# Altium schematic sheet XMC4800-Core.SchDoc: XMC4800-Core
size A4
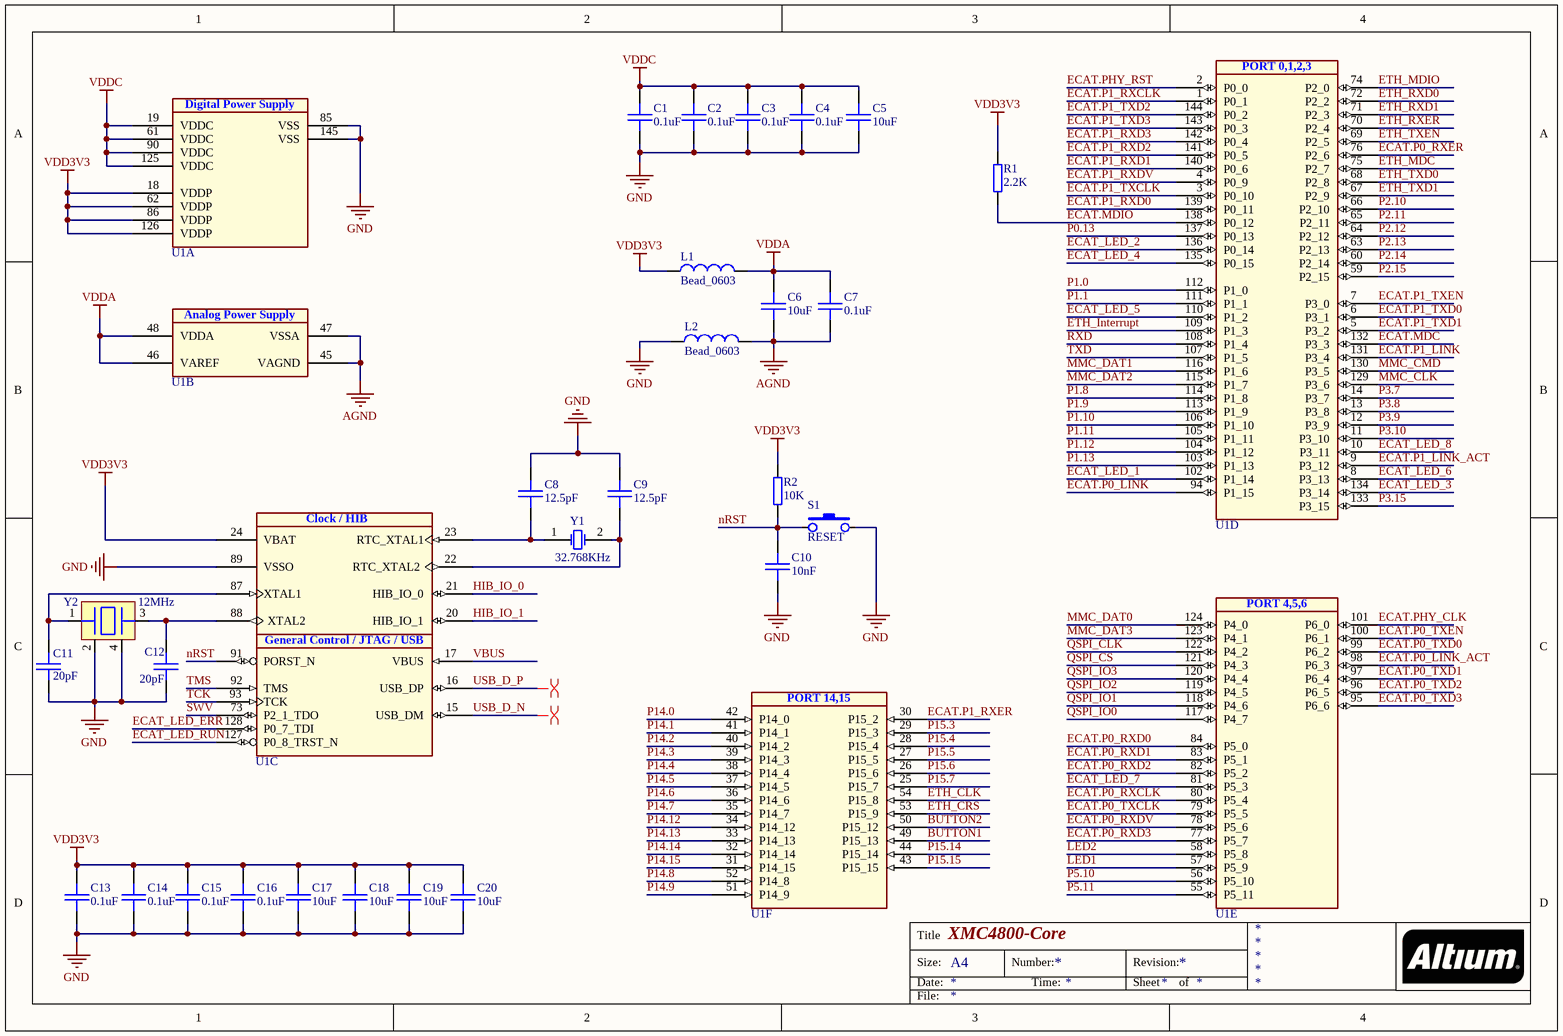
[diagram p0: XMC4800-Core.SchDoc]

## Parts
C1  0.1uF  [CAP-0603]
C2  0.1uF  [CAP-0603]
C3  0.1uF  [CAP-0603]
C4  0.1uF  [CAP-0603]
C5  10uF  [CAP-0603]
C6  10uF  [CAP-0603]
C7  0.1uF  [CAP-0603]
C8  12.5pF  [CAP-0603]
C9  12.5pF  [CAP-0603]
C10  10nF  [CAP-0603]
C11  20pF  [CAP-0603]
C12  20pF  [CAP-0603]
C13  0.1uF  [CAP-0603]
C14  0.1uF  [CAP-0603]
C15  0.1uF  [CAP-0603]
C16  0.1uF  [CAP-0603]
C17  10uF  [CAP-0603]
C18  10uF  [CAP-0603]
C19  10uF  [CAP-0603]
C20  10uF  [CAP-0603]
L1  Bead_0603  [L-0603]
L2  Bead_0603  [L-0603]
R1  2.2K  [RES-0603]
R2  10K  [RES-0603]
S1  RESET  [KEY_3X4X2]
U1  XMC4800-F144F1024  [QFP50P2200X2200X160-145N-2]  (value not drawn)  (parts A,B,C,D,E,F of 6)
Y1  32.768KHz  [FC-135(3215)]
Y2  12MHz  [LC-SMD-3225_4P]

## Nets
AGND: C6.2 C7.2 L2.2 U1.45(VAGND) U1.47(VSSA)
GND: C1.2 C2.2 C3.2 C4.2 C5.2 C8.1 C9.1 C10.2 C11.2 C12.2 C13.2 C14.2 C15.2 C16.2 C17.2 C18.2 C19.2 C20.2 L2.1 S1.2 U1.85(VSS) U1.89(VSSO) U1.145(VSS) Y2.2 Y2.4
VDD3V3: C13.1 C14.1 C15.1 C16.1 C17.1 C18.1 C19.1 C20.1 L1.1 R1.2 R2.2 U1.18(VDDP) U1.24(VBAT) U1.62(VDDP) U1.86(VDDP) U1.126(VDDP)
VDDA: C6.1 C7.1 L1.2 U1.46(VAREF) U1.48(VDDA)
VDDC: C1.1 C2.1 C3.1 C4.1 C5.1 U1.19(VDDC) U1.61(VDDC) U1.90(VDDC) U1.125(VDDC)
BUTTON1: U1.49(P15_13)
BUTTON2: U1.50(P15_12)
ECAT.MDC: U1.132(P3_3)
ECAT.MDIO: R1.1 U1.138(P0_12)
ECAT.P0_LINK: U1.94(P1_15)
ECAT.P0_LINK_ACT: U1.98(P6_3)
ECAT.P0_RXCLK: U1.80(P5_4)
ECAT.P0_RXD0: U1.84(P5_0)
ECAT.P0_RXD1: U1.83(P5_1)
ECAT.P0_RXD2: U1.82(P5_2)
ECAT.P0_RXD3: U1.77(P5_7)
ECAT.P0_RXDV: U1.78(P5_6)
ECAT.P0_RXER: U1.76(P2_6)
ECAT.P0_TXCLK: U1.79(P5_5)
ECAT.P0_TXD0: U1.99(P6_2)
ECAT.P0_TXD1: U1.97(P6_4)
ECAT.P0_TXD2: U1.96(P6_5)
ECAT.P0_TXD3: U1.95(P6_6)
ECAT.P0_TXEN: U1.100(P6_1)
ECAT.P1_LINK: U1.131(P3_4)
ECAT.P1_LINK_ACT: U1.9(P3_12)
ECAT.P1_RXCLK: U1.1(P0_1)
ECAT.P1_RXD0: U1.139(P0_11)
ECAT.P1_RXD1: U1.140(P0_6)
ECAT.P1_RXD2: U1.141(P0_5)
ECAT.P1_RXD3: U1.142(P0_4)
ECAT.P1_RXDV: U1.4(P0_9)
ECAT.P1_RXER: U1.30(P15_2)
ECAT.P1_TXCLK: U1.3(P0_10)
ECAT.P1_TXD0: U1.6(P3_1)
ECAT.P1_TXD1: U1.5(P3_2)
ECAT.P1_TXD2: U1.144(P0_2)
ECAT.P1_TXD3: U1.143(P0_3)
ECAT.P1_TXEN: U1.7(P3_0)
ECAT.PHY_CLK: U1.101(P6_0)
ECAT.PHY_RST: U1.2(P0_0)
ECAT_LED_1: U1.102(P1_14)
ECAT_LED_2: U1.136(P0_14)
ECAT_LED_3: U1.134(P3_14)
ECAT_LED_4: U1.135(P0_15)
ECAT_LED_5: U1.110(P1_2)
ECAT_LED_6: U1.8(P3_13)
ECAT_LED_7: U1.81(P5_3)
ECAT_LED_8: U1.10(P3_11)
ECAT_LED_ERR: U1.128(P0_7_TDI)
ECAT_LED_RUN: U1.127(P0_8_TRST_N)
ETH_CLK: U1.54(P15_8)
ETH_CRS: U1.53(P15_9)
ETH_Interrupt: U1.109(P1_3)
ETH_MDC: U1.75(P2_7)
ETH_MDIO: U1.74(P2_0)
ETH_RXD0: U1.72(P2_2)
ETH_RXD1: U1.71(P2_3)
ETH_RXER: U1.70(P2_4)
ETH_TXD0: U1.68(P2_8)
ETH_TXD1: U1.67(P2_9)
ETH_TXEN: U1.69(P2_5)
HIB_IO_0: U1.21(HIB_IO_0)
HIB_IO_1: U1.20(HIB_IO_1)
LED1: U1.57(P5_9)
LED2: U1.58(P5_8)
MMC_CLK: U1.129(P3_6)
MMC_CMD: U1.130(P3_5)
MMC_DAT0: U1.124(P4_0)
MMC_DAT1: U1.116(P1_6)
MMC_DAT2: U1.115(P1_7)
MMC_DAT3: U1.123(P4_1)
nRST: C10.1 R2.1 S1.1 U1.91(PORST_N)
P0.13: U1.137(P0_13)
P1.0: U1.112(P1_0)
P1.1: U1.111(P1_1)
P1.8: U1.114(P1_8)
P1.9: U1.113(P1_9)
P1.10: U1.106(P1_10)
P1.11: U1.105(P1_11)
P1.12: U1.104(P1_12)
P1.13: U1.103(P1_13)
P2.10: U1.66(P2_10)
P2.11: U1.65(P2_11)
P2.12: U1.64(P2_12)
P2.13: U1.63(P2_13)
P2.14: U1.60(P2_14)
P2.15: U1.59(P2_15)
P3.7: U1.14(P3_7)
P3.8: U1.13(P3_8)
P3.9: U1.12(P3_9)
P3.10: U1.11(P3_10)
P3.15: U1.133(P3_15)
P5.10: U1.56(P5_10)
P5.11: U1.55(P5_11)
P14.0: U1.42(P14_0)
P14.1: U1.41(P14_1)
P14.2: U1.40(P14_2)
P14.3: U1.39(P14_3)
P14.4: U1.38(P14_4)
P14.5: U1.37(P14_5)
P14.6: U1.36(P14_6)
P14.7: U1.35(P14_7)
P14.8: U1.52(P14_8)
P14.9: U1.51(P14_9)
P14.12: U1.34(P14_12)
P14.13: U1.33(P14_13)
P14.14: U1.32(P14_14)
P14.15: U1.31(P14_15)
P15.3: U1.29(P15_3)
P15.4: U1.28(P15_4)
P15.5: U1.27(P15_5)
P15.6: U1.26(P15_6)
P15.7: U1.25(P15_7)
P15.14: U1.44(P15_14)
P15.15: U1.43(P15_15)
QSPI_CLK: U1.122(P4_2)
QSPI_CS: U1.121(P4_3)
QSPI_IO0: U1.117(P4_7)
QSPI_IO1: U1.118(P4_6)
QSPI_IO2: U1.119(P4_5)
QSPI_IO3: U1.120(P4_4)
RXD: U1.108(P1_4)
SWV: U1.73(P2_1_TDO)
TCK: U1.93(TCK)
TMS: U1.92(TMS)
TXD: U1.107(P1_5)
USB_D_N: U1.15(USB_DM)
USB_D_P: U1.16(USB_DP)
VBUS: U1.17(VBUS)
NetC8_2: C8.2 U1.23(RTC_XTAL1) Y1.1(OSC1)
NetC9_2: C9.2 U1.22(RTC_XTAL2) Y1.2(OSC2)
NetC11_1: C11.1 U1.87(XTAL1) Y2.1
NetC12_1: C12.1 U1.88(XTAL2) Y2.3

## Layout directives
differential pair: USB_D_N, USB_D_P

## Notes on the sheet
- Title
- Size:
- Date:
- A4
- Number:
- Time:
- Revision:
- Sheet
- of
- File:
- (in symbol XMC4800-F144F1024, part A) Digital Power Supply
- (in symbol XMC4800-F144F1024, part B) Analog Power Supply
- (in symbol XMC4800-F144F1024, part C) Clock / HIB; General Control / JTAG / USB
- (in symbol XMC4800-F144F1024, part D) PORT 0,1,2,3
- (in symbol XMC4800-F144F1024, part E) PORT 4,5,6
- (in symbol XMC4800-F144F1024, part F) PORT 14,15

## Library data of the parts
C1-C20 = C_0603: 陶瓷贴片电容0603; tolerance: 10%; voltage: 50V; ESR: 1.73mOhm; IRMS: 5.59A; Series: X7R
  C1-C4 C7 C13-C16: C_value: 0.1uF
  C5 C6 C17-C20: C_value: 10uF
  C8 C9: C_value: 12.5pF
  C10: C_value: 10nF
  C11 C12: C_value: 20pF
L1 L2 = Bead_0603: 贴片磁珠0603; Impedance: 120Ohm; Current: 2A
R1 R2 = R_0603: 贴片电阻0603; tolerance: 5%; voltage: 50V; power: 0.063W
  R1: R_value: 2.2K
  R2: R_value: 10K
S1 = KEY: 轻触开关3X4X2
U1 = XMC4800-F144F1024: XMC4000 Family Microcontroller for Industrial Applications, ARM® Cortex™-M4, 32-bit processor core,Flash 1024 Kbytes,SRAM 352 Kbytes (Temperature Range -40°C to 85°C); Manufacturer: Infineon Technologies; ManufacturerPartNumber: XMC4800-F144F1024; PackageReference: PG-LQFP-144
Y1 = OSC_32768: 32.768KHz时钟晶振; X_value: 32.768KHz
Y2 = XTAL_PASSIVE: 贴片无源晶振(3225); X_value: 12MHz